# Altium schematic sheet plp-cbot_2с.SchDoc: Плата ПЛП - CBOT
size 420 x 297 mm; ApprovedBy: Судаков; CheckedBy: Казанов; Author: Сарайкин; CompanyName: ООО "ОКБ Вектор"; DocumentNumber: ВГАР.xxxxxx.xxx Э3; SheetNumber: 1; SheetTotal: 1; PageSetup: Record=PageOptions|CenterHorizontal=False|CenterVertical=False|PrintScale=2.88|XCorrection=0.00|YCorrection=0.00|PrintKind=1|BorderSize=5000000|LeftOffset=0|BottomOffset=0|Orientation=2|PaperLength=4200|PaperWidth=2970|Scale=100|PaperSource=7|PrintQuality=600|MediaType=1|DitherType=10|PrintScaleMode=1|PaperKind=A3; Title2str: Схема электрическая; NormInspection: Коваленко; DocumentType: принципиальная; FirstReferrence: ВГАР.xxxxxx.xxx Э3; Rule: PcbType=ProtelPcb
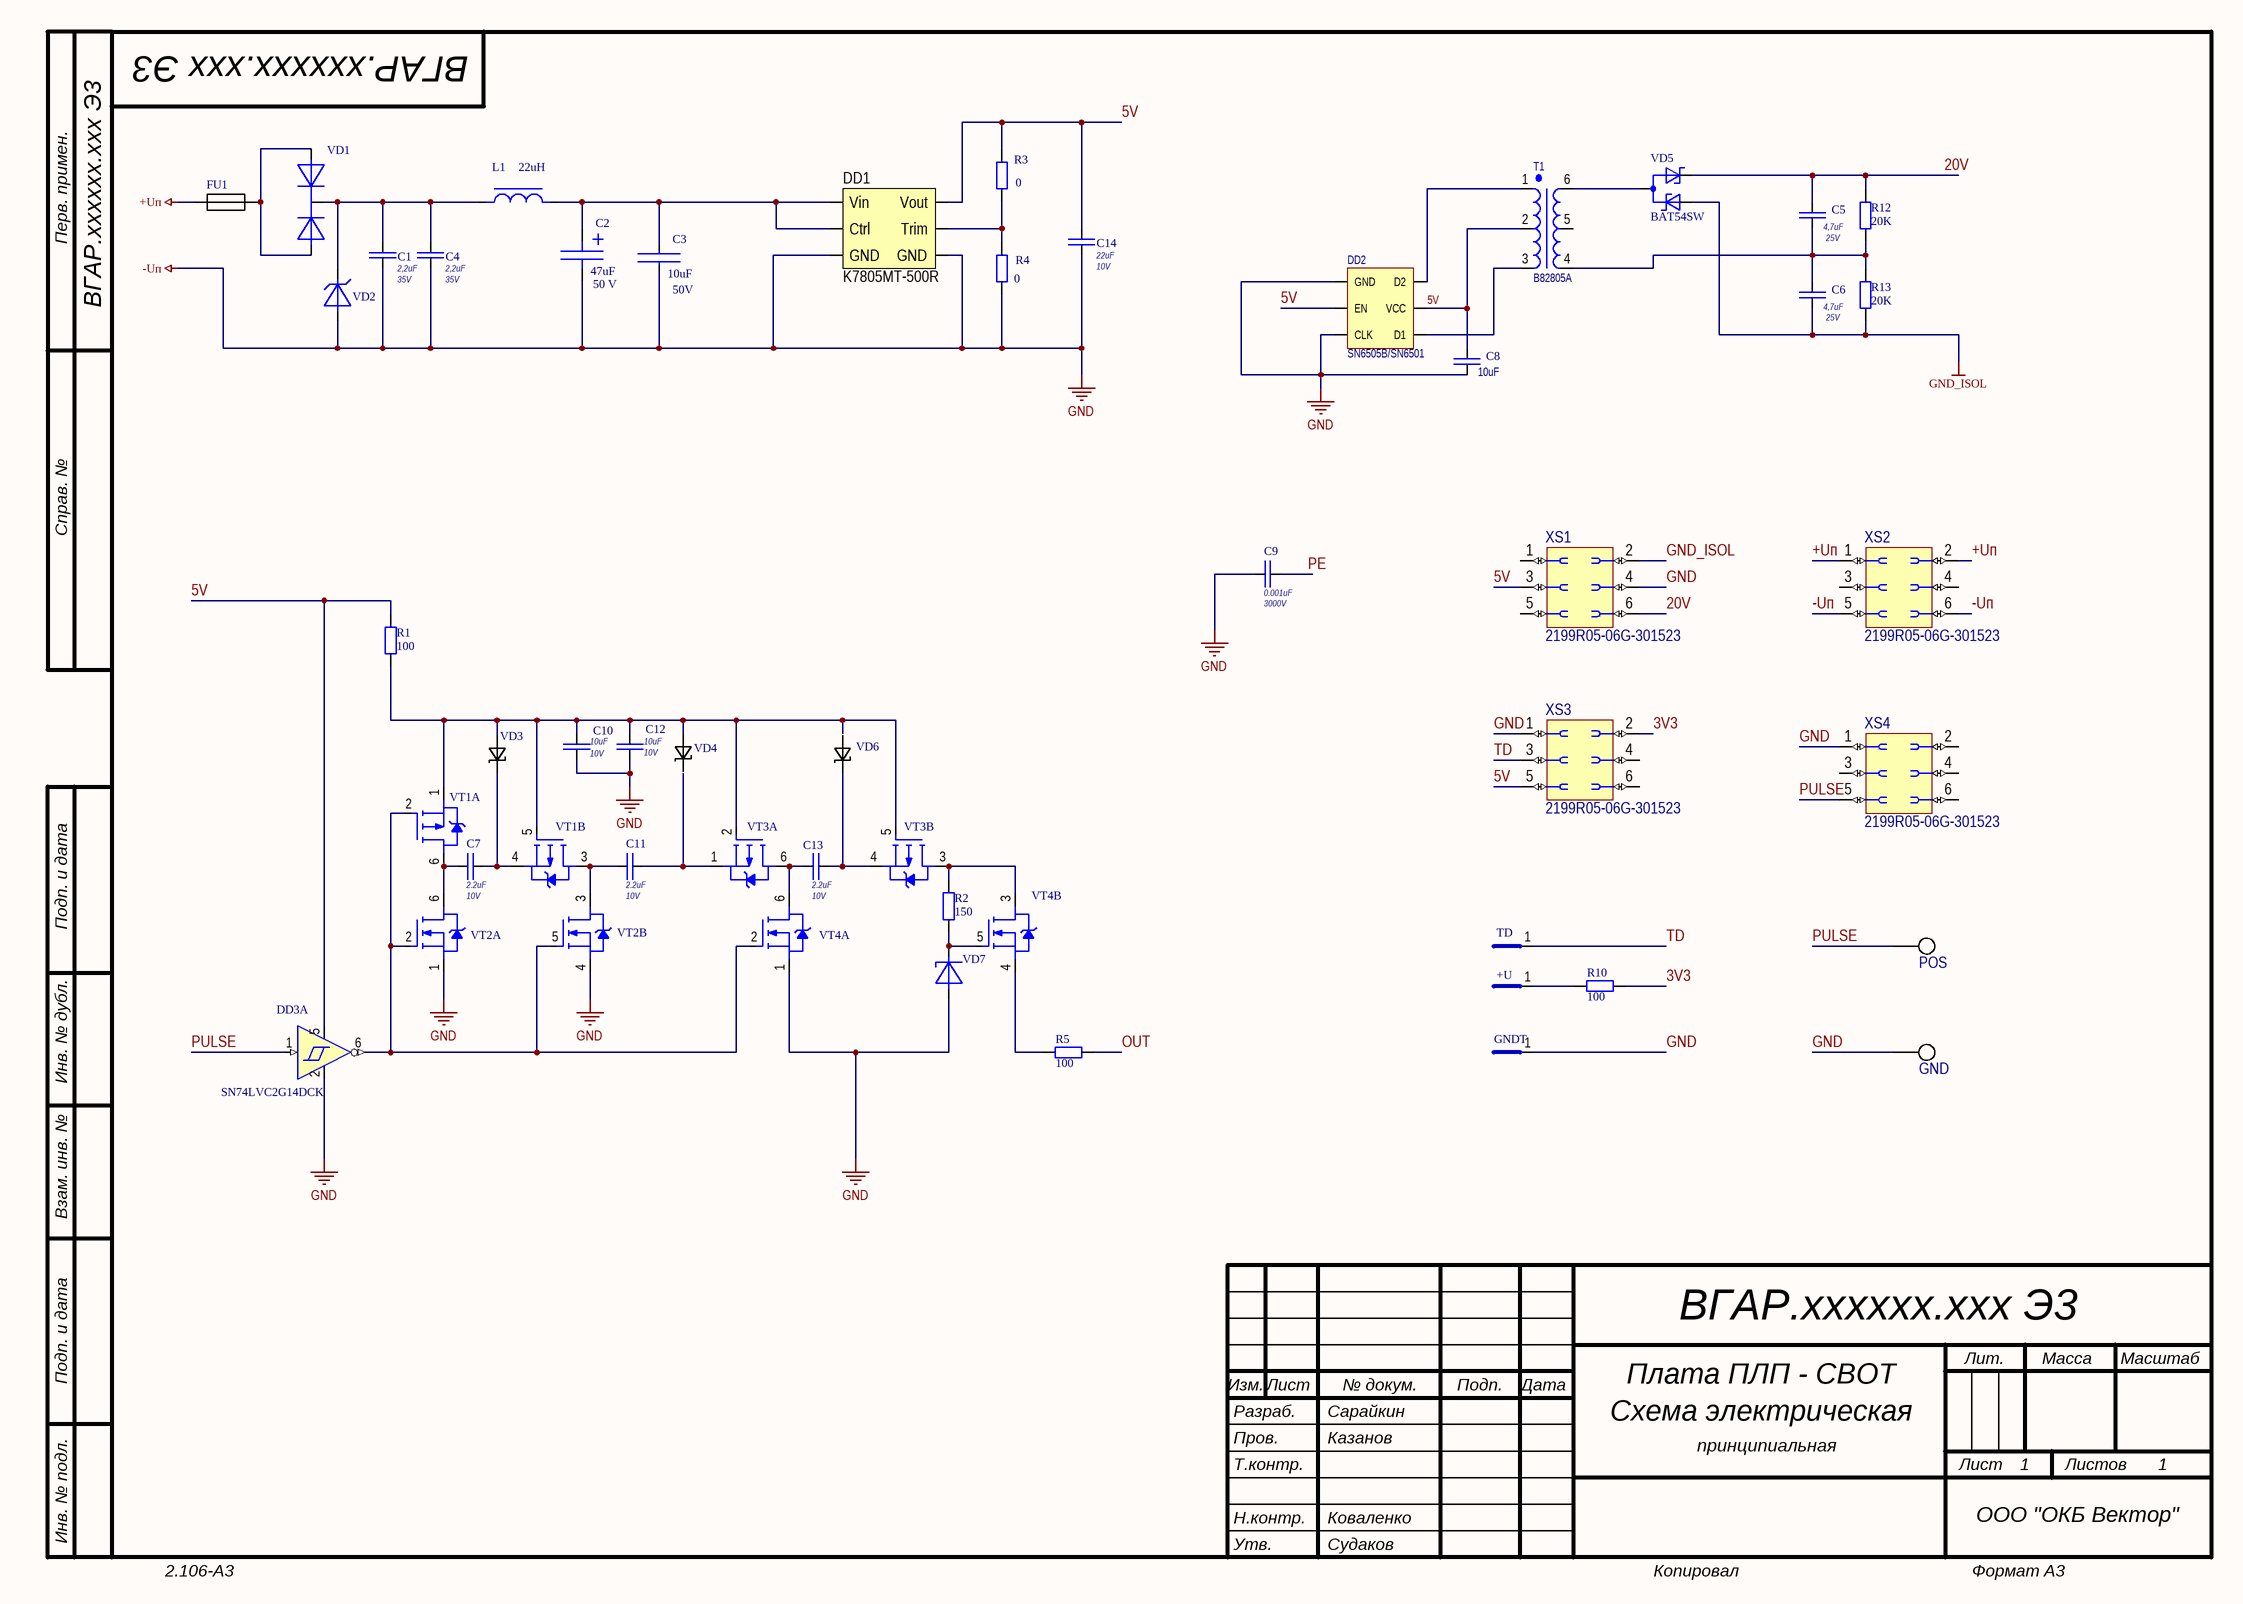
[diagram p0: plp-cbot_2с.SchDoc]

## Parts
+U  smd_pin  [smd_pin]  (value not drawn)
C1  Rated DC Voltage: 35V  [CAPC_0805(2012)X10L]  (hidden comment: 2,2uF)
C2  47uF  Rated DC Voltage: 50 V  [CAPSM_D_M7878X54L]
C3  value 10uF  [CAPC_1210(3225)X10L]  (hidden comment: CAPC_1210(3225)X10)
C4  Rated DC Voltage: 35V  [CAPC_0805(2012)X10L]  (hidden comment: 2,2uF)
C5  Rated DC Voltage: 25V  [CAPC_0603(1608)X080L]  (hidden comment: 4,7uF)
C6  Rated DC Voltage: 25V  [CAPC_0603(1608)X080L]  (hidden comment: 4,7uF)
C7  value 2.2uF  Rated DC Voltage: 10V  [CAPC_0603(1608)X080L]  (hidden comment: Capacitor Ceramic)
C8  10uF  [CAPC_0603(1608)X080L]
C9  Rated DC Voltage: 3000V  [CAPC_1812(4532)X16L]  (hidden comment: 0.001uF)
C10  value 10uF  Rated DC Voltage: 10V  [CAPC_0603(1608)X080L]  (hidden comment: Capacitor Ceramic)
C11  value 2.2uF  Rated DC Voltage: 10V  [CAPC_0603(1608)X080L]  (hidden comment: Capacitor Ceramic)
C12  value 10uF  Rated DC Voltage: 10V  [CAPC_0603(1608)X080L]  (hidden comment: Capacitor Ceramic)
C13  value 2.2uF  Rated DC Voltage: 10V  [CAPC_0603(1608)X080L]  (hidden comment: Capacitor Ceramic)
C14  Rated DC Voltage: 10V  [CAPC_0805(2012)X10L]  (hidden comment: 22uF)
DD1  K7805MT-500R  [DFN_K7805]
DD2  SN6505B/SN6501  [SOT23-6]
DD3  SN74LVC2G14DCK  [SC-70-6]  (part A of 2)
FU1  MF-MSMF  [FU4532(1812)X06N]  (value not drawn)
GND  Testpoint_HS1mm  [TestPoint(1mm_HS)]  (value not drawn)
GNDT  smd_pin  [smd_pin]  (value not drawn)
L1  value 22uH  [CDRH4D28_INDP5050X28N]  (hidden comment: CDRH4D28)
POS  Testpoint_HS1mm  [TestPoint(1mm_HS)]  (value not drawn)
R1  value 100  [RESC1608(0603)X04L]  (hidden comment: R0603L)
R2  value 150  [RESC1608(0603)X04L]  (hidden comment: R0603L)
R3  0  [RESC1608(0603)X04L]
R4  0  [RESC1608(0603)X04L]
R5  100  [RESC1608(0603)X04L]
R10  value 100  [RESC1608(0603)X04L]  (hidden comment: R0603L)
R12  20K  [RESC1608(0603)X04L]
R13  20K  [RESC1608(0603)X04L]
T1  B82805A  [B82805A]
TD  smd_pin  [smd_pin]  (value not drawn)
VD1  BAV70W  [SC-70]  (value not drawn)
VD2  SMBJ33A  [SMB]  (value not drawn)
VD3  BAT54XV2  [SOD523 - ONs]  (value not drawn)
VD4  BAT54XV2  [SOD523 - ONs]  (value not drawn)
VD5  BAT54SW  [SC-70]
VD6  BAT54XV2  [SOD523 - ONs]  (value not drawn)
VD7  BZX585  [SOD523]  (value not drawn)
VT1  BSS84AKS  [SC-70-6]  (value not drawn)  (parts A,B of 2)
VT2  BSS138PS  [SC-70-6]  (value not drawn)  (parts A,B of 2)
VT3  BSS84AKS  [SC-70-6]  (value not drawn)  (parts A,B of 2)
VT4  BSS138PS  [SC-70-6]  (value not drawn)  (parts A,B of 2)
XS1  2199R05-06G-301523  [CON: PLL-6(2x3R1.27female)]
XS2  2199R05-06G-301523  [CON: PLL-6(2x3R1.27female)]
XS3  2199R05-06G-301523  [CON: PLL-6(2x3R1.27female)]
XS4  2199R05-06G-301523  [CON: PLL-6(2x3R1.27female)]

## Nets
5V: C8.2 C14.2 DD1.3(Vout) DD2.2(VCC) DD2.5(EN) DD3.5(Vdd) R1.2 R3.2 T1.2 XS1.3 XS3.5  [also labelled Vdd]
+Uп: FU1.1 XS2.1 XS2.2
-Uп: C1.1 C2.2 C3.1 C4.1 C8.1 C9.1 C10.1 C12.1 C14.1 DD1.2(GND) DD1.5(GND) DD2.4(GND) DD2.6(CLK) DD3.2(GND) GND.1 GNDT.1 R4.1 VD2.2(A) VD7.2(A) VT2.1(S1) VT2.4(S2) VT4.1(S1) XS1.4 XS2.5 XS2.6 XS3.1 XS4.1  [also labelled GND]
GND_ISOL: C6.1 R13.1 VD5.1(A) XS1.2
3V3: R10.2 XS3.2
20V: C5.2 R12.2 VD5.2(C) XS1.6
OUT: R5.2
PE: C9.2
PULSE: DD3.1(A1) POS.1 XS4.5
TD: TD.1 XS3.3
Net+U_1: +U.1 R10.1
NetC1_2: C1.2 C4.2 L1.1 VD1.3(OC) VD2.1(C)
NetC2_1: C2.1 C3.2 DD1.1(Vin) DD1.6(Ctrl) L1.2
NetC5_1: C5.1 C6.2 R12.1 R13.2 T1.4
NetC7_1: C7.1 VT1.6(D1) VT2.6(D1)
NetC7_2: C7.2 VD3.2(catode) VT1.4(S2)
NetC10_2: C10.2 C12.2 R1.1 VD3.1(anode) VD4.1(anode) VT1.1(S1) VT1.5(G2) VT3.2(G1) VT3.5(G2)
NetC11_1: C11.1 VT1.3(D2) VT2.3(D2)
NetC11_2: C11.2 VT3.1(S1)
NetC13_1: C13.1 VT3.6(D1) VT4.6(D1)
NetC13_2: C13.2 VD6.2(catode) VT3.4(S2)
NetDD1_4: DD1.4(Trim) R3.1 R4.2
NetDD2_1: DD2.1(D1) T1.3
NetDD2_3: DD2.3(D2) T1.1
NetDD3_6: DD3.6(Y1) VT1.2(G1) VT2.2(G1) VT2.5(G2) VT4.2(G1)
NetFU1_2: FU1.2 VD1.1(A) VD1.2(A)
NetR2_1: R2.1 VD7.1(C) VT4.5(G2)
NetR2_2: R2.2 VT3.3(D2) VT4.3(D2)
NetR5_1: R5.1 VT4.4(S2)
NetT1_6: T1.6 VD5.3(OAC)

Not connected (* = marked no-connect by the designer): T1 5; VD4 2(catode); VD6 1(anode); XS1 1 5; XS2 3 4; XS3 4 6; XS4 2 3 4 6

## Notes on the sheet
- Vout=4nVin
- Перв. примен.
- Справ. №
- Подп. и дата
- Инв. № дубл.
- Взам. инв. №
- Разраб.
- Изм.
- Лист
- № докум.
- Подп.
- Дата
- Лит.
- Масса
- Масштаб
- Пров.
- Т.контр.
- Листов
- Инв. № подл.
- Утв.
- Н.контр.
- 2.106-A3
- Копировал
- Формат А3
- (in symbol CAPC_1210(3225)X10) 50V

## Library data of the parts
C1 C4 C14 = 0805 - X7R - 16V - 4.7uF: Конденсатор; Manufacturer: Murata; PartNumber: GRM21BR71C475KA73L - 0805 - 4,7 мкФ ± 10 % - 16 В - X7R; ReplacementPart1Manufacturer: TDK; ReplacementPart2Manufacturer: Taiyo Yuden; TC Code: X7R; Tolerance: ±10%; Case: 0805; ComponentLink1Description: Global Data; ComponentLink1URL: http://www.murata.com/products/capacitor/tech_data/index.html; ComponentLink2Description: Part Data Sheet; ComponentLink2URL: *; ComponentLink3Description: Replacement Data Sheet; ComponentLink3URL: *; ComponentLink4Description: Replacement 2 Data Sheet; ComponentLink4URL: *; ReplacementPart1PartNumber: *; ReplacementPart2PartNumber: *; Ripple Current Rating: *; Temperature Range: -55 to +125°C
  C1 C4: Value: 2,2uF
  C14: Value: 22uF
C2 = SMD 5.3XD6.3 ALUM 22uFx50V: Конденсатор; Manufacturer: Panasonic; OrderCode: EEE1HA220WP - 22 мкФ - 50 В; Rated T: -40 to +85°C; Tolerance: ±20%; CaseSize: D6.3X5.4; CaseCode: D; PartNumber: *; Series: SV; Value: 47uF
C3 = CAPC_1210(3225)X10: Capacitor Chip
C5 C6 C8 = Capacitor Ceramic: Конденсатор; Manufacturer: Murata; ReplacementPart1Manufacturer: TDK; ReplacementPart2Manufacturer: Taiyo Yuden; ESR: * mOhm; OrderCode: 0603 - 0,022мкФ ±10% - 50В - X7R; TC Code: X7R; Tolerance: ±10%; Case: 0603; ComponentLink1Description: Global Data; ComponentLink1URL: http://www.murata.com/products/capacitor/tech_data/index.html; ComponentLink2Description: Part Data Sheet; ComponentLink2URL: *; ComponentLink3Description: Replacement Data Sheet; ComponentLink3URL: *; ComponentLink4Description: Replacement 2 Data Sheet; ComponentLink4URL: *; PartNumber: *; ReplacementPart1PartNumber: *; ReplacementPart2PartNumber: *; Ripple Current Rating: *; Temperature Range: -55 to +125°C
  C5 C6: Value: 4,7uF
  C8: Value: 10uF
C7 C10-C13 = Capacitor Ceramic: Конденсатор; Manufacturer: Murata; ReplacementPart1Manufacturer: TDK; ReplacementPart2Manufacturer: Taiyo Yuden; ESR: * mOhm; OrderCode: 0603 - 2,2мкФ ±10% - 10В - X5R; TC Code: X5R; Tolerance: ±10%; Case: 0603; ComponentLink1Description: Global Data; ComponentLink1URL: http://www.murata.com/products/capacitor/tech_data/index.html; ComponentLink2Description: Part Data Sheet; ComponentLink2URL: *; ComponentLink3Description: Replacement Data Sheet; ComponentLink3URL: *; ComponentLink4Description: Replacement 2 Data Sheet; ComponentLink4URL: *; PartNumber: *; ReplacementPart1PartNumber: *; ReplacementPart2PartNumber: *; Ripple Current Rating: *; Temperature Range: -55 to +125°C
C9 = Capacitor Ceramic: Конденсатор; Manufacturer: Murata; PartNumber: 0603 - 0,1 мкФ ± 10 % - 50 В - X7R; ReplacementPart1Manufacturer: TDK; ReplacementPart2Manufacturer: Taiyo Yuden; TC Code: X7R; Tolerance: ±10%; Case: 0603; ComponentLink1Description: Global Data; ComponentLink1URL: http://www.murata.com/products/capacitor/tech_data/index.html; ComponentLink2Description: Part Data Sheet; ComponentLink2URL: *; ComponentLink3Description: Replacement Data Sheet; ComponentLink3URL: *; ComponentLink4Description: Replacement 2 Data Sheet; ComponentLink4URL: *; ReplacementPart1PartNumber: *; ReplacementPart2PartNumber: *; Ripple Current Rating: *; Temperature Range: -55 to +125°C; Value: 0.001uF
DD1 = K7805MT-500R: DC/DC converter; ComponentLink1Description: Datasheet; ComponentLink1URL: https://www.mornsun-power.com/html/pdf/K7805MT-500R4.html
DD2 = SN6505A: Low-Noise 1-A Transformer Drivers for Isolated Power Supplies; ComponentLink1Description: Datasheet; ComponentLink1URL: https://www.ti.com/lit/ds/symlink/sn6505a.pdf?ts=1606984863638&ref_url=https%253A%252F%252Fwww.google.com%252F
DD3 = NC7WZ14P6X: UHS Dual Inverter with Schmitt Trigger Inputs
FU1 = MF-MSMF: Самовостанавливающийся предохранитель; Manufacturer: Bourns; PartNumber: MF-MSMF 010/60-2; ReplacementPart1Manufacturer: Tyco-Electronics; ReplacementPart1PartNumber: MINISMDC010F-2; ComponentLink1Description: Data Sheet; ComponentLink1URL: http://www.bourns.com/data/global/pdfs/mfmsmf.pdf; ComponentLink2Description: Replacement 1 Data Sheet; ComponentLink2URL: http://www.tycoelectronics.com/catalog/bin/TE.Connect?S=23159&M=PPROP&P=152415,173314&BML=10576,17593&LG=1&PG=1&IDS=489613,489486&N=1
R1 R2 R10 = R0603L: Резистор; Manufacturer: Bourns; Max Rated DC Voltage: 100 В; Power: 1/10 Вт; Rated DC Voltage: 50 В; Rated T: -55 °C to +125 °C; Resistance Code: 0603 {Value} Ом ±1 %; TKR: ±100 ppm; Tolerance: ±1 %; ComponentLink1Description: Data Sheet; ComponentLink1URL: http://smd.ru/files/upload/1207/ru/chip-resis.pdf; Case: 0603; ComponentLink2Description: Specific Res Only; ComponentLink2URL: *; ComponentLink3Description: Replacement Data Sheet; ComponentLink3URL: *; ComponentLink4Description: Replacement 2 Data Sheet; ComponentLink4URL: *; OrderCode: *; PartNumber: *; ReplacementPart1Manufacturer: *; ReplacementPart1PartNumber: *; ReplacementPart2Manufacturer: *; ReplacementPart2PartNumber: *; Temperature Range: -55 to +125°C
R3 R4 R12 R13 = R0603L: Резистор; Manufacturer: Bourns; PartNumber: 0603 - {Value} Ом ± 1 %; Max Rated DC Voltage: 100 В; Power: 1/10 Вт; Rated DC Voltage: 50 В; Rated T: -55 °C to +125 °C; TKR: ±100 ppm; Tolerance: ±1 %; ComponentLink1Description: Data Sheet; ComponentLink1URL: http://smd.ru/files/upload/1207/ru/chip-resis.pdf; Case: 0603; ComponentLink2Description: Specific Res Only; ComponentLink2URL: *; ComponentLink3Description: Replacement Data Sheet; ComponentLink3URL: *; ComponentLink4Description: Replacement 2 Data Sheet; ComponentLink4URL: *; ReplacementPart1Manufacturer: *; ReplacementPart1PartNumber: *; ReplacementPart2Manufacturer: *; ReplacementPart2PartNumber: *; Temperature Range: -55 to +125°C
  R3 R4: Value: 0
  R12 R13: Value: 20K
R5 = R0603L: Резистор; Manufacturer: Bourns; PartNumber: 0603 - {Value} Ом ± 1 %; Max Rated DC Voltage: 100 В; Power: 1/10 Вт; Rated DC Voltage: 50 В; Rated T: -55 °C to +125 °C; TKR: ±100 ppm; Tolerance: ±1 %; Value: 1k; ComponentLink1Description: Data Sheet; ComponentLink1URL: http://smd.ru/files/upload/1207/ru/chip-resis.pdf; Case: 0603; ComponentLink2Description: Specific Res Only; ComponentLink2URL: *; ComponentLink3Description: Replacement Data Sheet; ComponentLink3URL: *; ComponentLink4Description: Replacement 2 Data Sheet; ComponentLink4URL: *; ReplacementPart1Manufacturer: *; ReplacementPart1PartNumber: *; ReplacementPart2Manufacturer: *; ReplacementPart2PartNumber: *; Temperature Range: -55 to +125°C
T1 = B82805A: SMT Push-Pull Transformers; ComponentLink1Description: Datasheet; ComponentLink1URL: https://www.tdk-electronics.tdk.com/inf/30/ds/b82805a.pdf
VD1 = BAV70W: Сборка диодная; Manufacturer: NXP; Package: SC-70; PartNumber: BAV70W; ComponentLink1Description: DataSheet; ComponentLink1URL: *; Power/Voltage: *; Type: *; ComponentLink2URL: *; ComponentLink3Description: Replacement2DataSheet; ComponentLink3URL: *; ComponentLink2Description: Replacement1DataSheet; ReplacementPart2TopMarking: *; ReplacementPart1Manufacturer: *; ReplacementPart1PartNumber: *; ReplacementPart1TopMarking: *; ReplacementPart2Manufacturer: *
VD2 = SMBJ33A: TVS Диод; ReplacementPart1Manufacturer: NXP; ReplacementPart1PartNumber: PTVS33VP1UP; ReplacementPart2Manufacturer: VISHAY; ReplacementPart2TopMarking: KC; Manufacturer: ST Microelectronics; StandOffVoltage: 33V; ComponentLink1Description: Data Sheet; ComponentLink1URL: http://www.st.com/internet/com/TECHNICAL_RESOURCES/TECHNICAL_LITERATURE/DATASHEET/CD00001366.pdf; ComponentLink2Description: Replacement 1 Data Sheet; ComponentLink2URL: http://www.nxp.com/documents/data_sheet/PTVSXP1UP_SER.pdf; ComponentLink3Description: Replacement 2 Data Sheet; PartNumber: SMBJ33A
VD3 VD4 VD6 = BAT54XV2: shottky diode; Manufacturer: ON Semiconductor; ComponentLink1Description: Data Sheet; ComponentLink2Description: Replacement 1 Data Sheet; ComponentLink3Description: Replacement 2 Data Sheet
VD5 = BAT54SW: Сборка диодная; Manufacturer: NXP; ReplacementPart1Manufacturer: ON Semiconductor; ReplacementPart1PartNumber: BAT54SWT1G; ReplacementPart1TopMarking: B8*; ReplacementPart2Manufacturer: Infineon; ReplacementPart2TopMarking: TS; ReplacementPart2PartNumber: BAT54-04W; TopMarking: 44; Package: SC-70; PartNumber: BAT54SW; ComponentLink1Description: DataSheet; ComponentLink1URL: http://www.nxp.com/documents/data_sheet/BAT54W.pdf; Power/Voltage: *; Type: *; ComponentLink2URL: http://www.onsemi.com/pub_link/Collateral/BAT54SWT1-D.PDF; ComponentLink3Description: Replacement2DataSheet; ComponentLink3URL: http://www.infineon.com/dgdl/bat54series.pdf?folderId=db3a30431400ef68011425f1ca2505e3&fileId=db3a304314dca3890115190b74210ea6; ComponentLink2Description: Replacement1DataSheet
VD7 = BZX585: Стабилитрон; Manufacturer: NXP; Package: SOD-323F; ComponentLink1Description: DataSheet; ComponentLink1URL: *; Power/Voltage: *; Type: *; ComponentLink2URL: *; ComponentLink3Description: Replacement2DataSheet; ComponentLink3URL: *; ComponentLink2Description: Replacement1DataSheet; ReplacementPart2TopMarking: *; ReplacementPart1Manufacturer: *; ReplacementPart1PartNumber: *; ReplacementPart1TopMarking: *; ReplacementPart2Manufacturer: *
VT1 VT3 = BSS84AKS: Сборка транзисторная; Manufacturer: Fairchild Semiconductor; ReplacementPart1Manufacturer: ON Semiconductor; ReplacementPart1TopMarking: TK; TopMarking: .16; ComponentLink1Description: Data Sheet; ComponentLink2Description: Replacement 1 Data Sheet; ComponentLink3URL: *; PartNumber: BSS84AKS; ReplacementPart2Manufacturer: *; ReplacementPart2PartNumber: *; ReplacementPart2TopMarking: *; ComponentLink3Description: *
VT2 VT4 = BSS138PS: Сборка транзисторная; Manufacturer: Fairchild Semiconductor; ReplacementPart1Manufacturer: ON Semiconductor; ReplacementPart1TopMarking: TK; TopMarking: .16; ComponentLink1Description: Data Sheet; ComponentLink2Description: Replacement 1 Data Sheet; ComponentLink3URL: *; PartNumber: BSS138PS; ReplacementPart2Manufacturer: *; ReplacementPart2PartNumber: *; ReplacementPart2TopMarking: *; ComponentLink3Description: *
XS1-XS4 = 2199R05-06G-301523In: Step 1.27
L1 = CDRH4D28: Part Number GOST: *